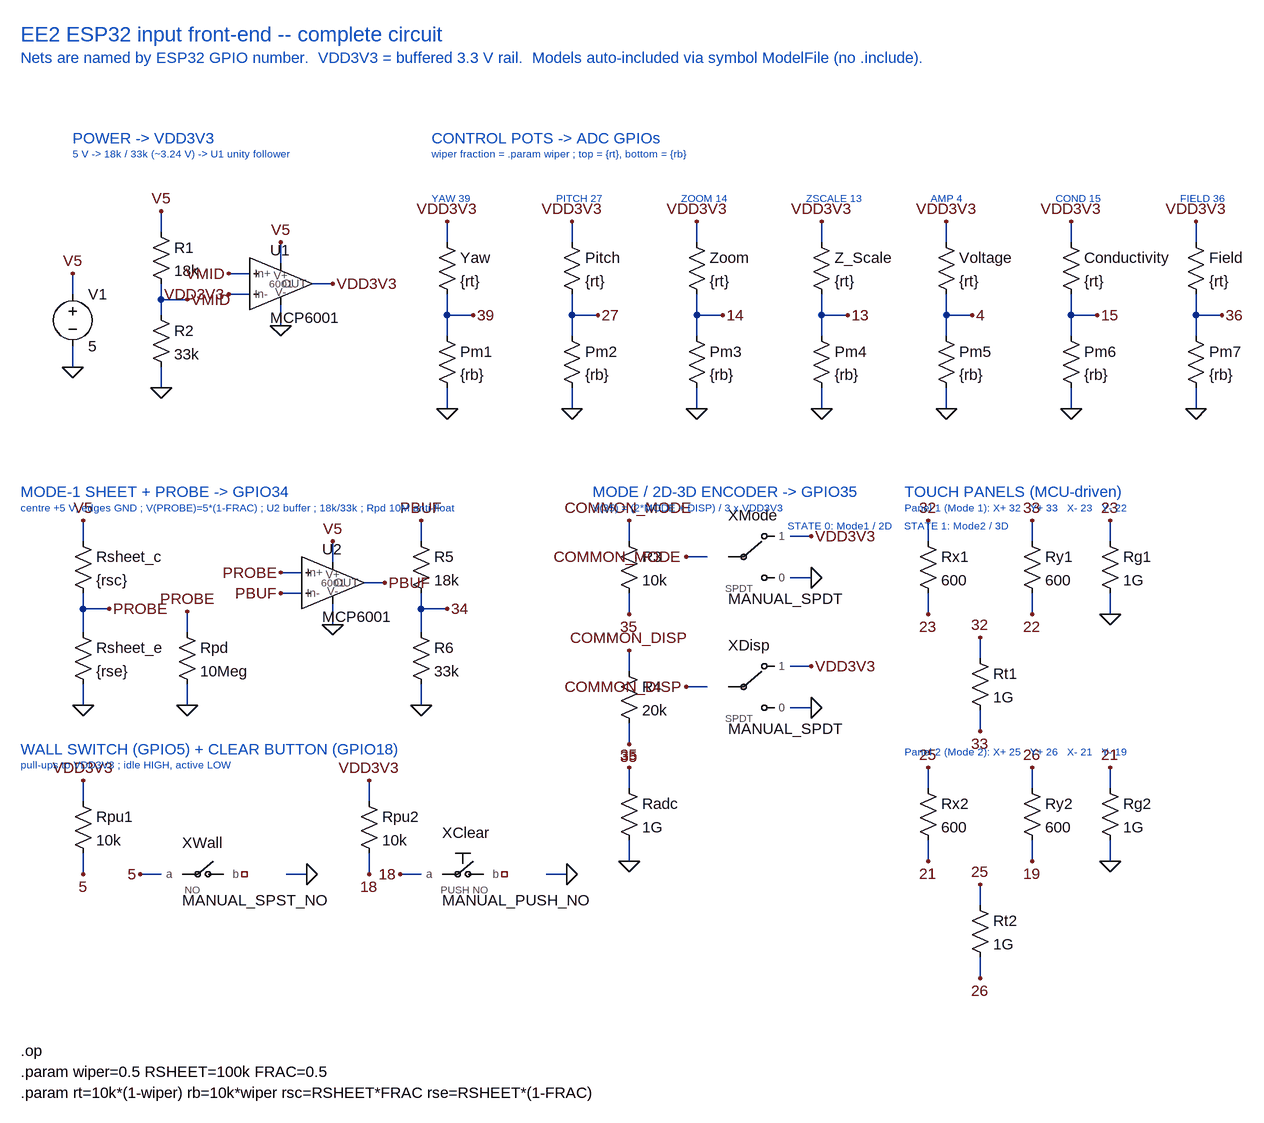
[diagram p0: schematic circuit_design_manual.asc]
circuit_design_manual.asc, the LTspice schematic file:
Version 4.1
SHEET 1 2000 1700
WIRE -400 -16 -400 16
WIRE -400 96 -400 128
WIRE -264 -112 -264 -80
WIRE -264 0 -264 48
WIRE -264 24 -224 24
WIRE -264 128 -264 160
WIRE -160 -16 -128 -16
WIRE -160 16 -128 16
WIRE -80 -64 -80 -32
WIRE -80 32 -80 64
WIRE -32 0 0 0
WIRE 176 -96 176 -64
WIRE 176 16 176 80
WIRE 176 48 216 48
WIRE 176 160 176 192
WIRE 368 -96 368 -64
WIRE 368 16 368 80
WIRE 368 48 408 48
WIRE 368 160 368 192
WIRE 560 -96 560 -64
WIRE 560 16 560 80
WIRE 560 48 600 48
WIRE 560 160 560 192
WIRE 752 -96 752 -64
WIRE 752 16 752 80
WIRE 752 48 792 48
WIRE 752 160 752 192
WIRE 944 -96 944 -64
WIRE 944 16 944 80
WIRE 944 48 984 48
WIRE 944 160 944 192
WIRE 1136 -96 1136 -64
WIRE 1136 16 1136 80
WIRE 1136 48 1176 48
WIRE 1136 160 1136 192
WIRE 1328 -96 1328 -64
WIRE 1328 16 1328 80
WIRE 1328 48 1368 48
WIRE 1328 160 1328 192
WIRE 456 364 456 396
WIRE 456 476 456 508
WIRE 544 420 576 420
WIRE 704 388 736 388
WIRE 704 452 736 452
WIRE 456 564 456 596
WIRE 456 676 456 708
WIRE 544 620 576 620
WIRE 704 588 736 588
WIRE 704 652 736 652
WIRE 456 744 456 776
WIRE 456 856 456 888
WIRE -384 364 -384 396
WIRE -384 476 -384 536
WIRE -384 500 -344 500
WIRE -384 616 -384 648
WIRE -224 504 -224 536
WIRE -224 616 -224 648
WIRE -80 444 -48 444
WIRE -80 476 -48 476
WIRE 0 396 0 428
WIRE 0 492 0 524
WIRE 48 460 80 460
WIRE 136 364 136 396
WIRE 136 476 136 536
WIRE 136 500 176 500
WIRE 136 616 136 648
WIRE 916 364 916 396
WIRE 916 476 916 508
WIRE 1076 364 1076 396
WIRE 1076 476 1076 508
WIRE 996 544 996 576
WIRE 996 656 996 688
WIRE 1196 364 1196 396
WIRE 1196 476 1196 508
WIRE 916 744 916 776
WIRE 916 856 916 888
WIRE 1076 744 1076 776
WIRE 1076 856 1076 888
WIRE 996 924 996 956
WIRE 996 1036 996 1068
WIRE 1196 744 1196 776
WIRE 1196 856 1196 888
WIRE -384 764 -384 796
WIRE -384 876 -384 908
WIRE -296 908 -264 908
WIRE -72 908 -40 908
WIRE 56 764 56 796
WIRE 56 876 56 908
WIRE 104 908 136 908
WIRE 328 908 360 908
FLAG -400 -16 V5
FLAG -400 128 0
FLAG -264 -112 V5
FLAG -224 24 VMID
FLAG -264 160 0
FLAG -160 -16 VMID
FLAG -160 16 VDD3V3
FLAG -80 -64 V5
FLAG -80 64 0
FLAG 0 0 VDD3V3
FLAG 176 -96 VDD3V3
FLAG 216 48 39
FLAG 176 192 0
FLAG 368 -96 VDD3V3
FLAG 408 48 27
FLAG 368 192 0
FLAG 560 -96 VDD3V3
FLAG 600 48 14
FLAG 560 192 0
FLAG 752 -96 VDD3V3
FLAG 792 48 13
FLAG 752 192 0
FLAG 944 -96 VDD3V3
FLAG 984 48 4
FLAG 944 192 0
FLAG 1136 -96 VDD3V3
FLAG 1176 48 15
FLAG 1136 192 0
FLAG 1328 -96 VDD3V3
FLAG 1368 48 36
FLAG 1328 192 0
FLAG 456 364 COMMON_MODE
FLAG 456 508 35
FLAG 544 420 COMMON_MODE
FLAG 736 388 VDD3V3
FLAG 736 452 0
FLAG 456 564 COMMON_DISP
FLAG 456 708 35
FLAG 544 620 COMMON_DISP
FLAG 736 588 VDD3V3
FLAG 736 652 0
FLAG 456 744 35
FLAG 456 888 0
FLAG -384 364 V5
FLAG -344 500 PROBE
FLAG -384 648 0
FLAG -224 504 PROBE
FLAG -224 648 0
FLAG -80 444 PROBE
FLAG -80 476 PBUF
FLAG 0 396 V5
FLAG 0 524 0
FLAG 80 460 PBUF
FLAG 136 364 PBUF
FLAG 176 500 34
FLAG 136 648 0
FLAG 916 364 32
FLAG 916 508 23
FLAG 1076 364 33
FLAG 1076 508 22
FLAG 996 544 32
FLAG 996 688 33
FLAG 1196 364 23
FLAG 1196 508 0
FLAG 916 744 25
FLAG 916 888 21
FLAG 1076 744 26
FLAG 1076 888 19
FLAG 996 924 25
FLAG 996 1068 26
FLAG 1196 744 21
FLAG 1196 888 0
FLAG -384 764 VDD3V3
FLAG -384 908 5
FLAG -296 908 5
FLAG -40 908 0
FLAG 56 764 VDD3V3
FLAG 56 908 18
FLAG 104 908 18
FLAG 360 908 0
SYMBOL voltage -400 0 R0
WINDOW 123 0 0 Left 0
WINDOW 39 0 0 Left 0
SYMATTR InstName V1
SYMATTR Value 5
SYMBOL res -280 -96 R0
SYMATTR InstName R1
SYMATTR Value 18k
SYMBOL res -280 32 R0
SYMATTR InstName R2
SYMATTR Value 33k
SYMBOL MCP6001 -80 0 R0
SYMATTR InstName U1
SYMBOL res 160 -80 R0
SYMATTR InstName Yaw
SYMATTR Value {rt}
SYMBOL res 160 64 R0
SYMATTR InstName Pm1
SYMATTR Value {rb}
SYMBOL res 352 -80 R0
SYMATTR InstName Pitch
SYMATTR Value {rt}
SYMBOL res 352 64 R0
SYMATTR InstName Pm2
SYMATTR Value {rb}
SYMBOL res 544 -80 R0
SYMATTR InstName Zoom
SYMATTR Value {rt}
SYMBOL res 544 64 R0
SYMATTR InstName Pm3
SYMATTR Value {rb}
SYMBOL res 736 -80 R0
SYMATTR InstName Z_Scale
SYMATTR Value {rt}
SYMBOL res 736 64 R0
SYMATTR InstName Pm4
SYMATTR Value {rb}
SYMBOL res 928 -80 R0
SYMATTR InstName Voltage
SYMATTR Value {rt}
SYMBOL res 928 64 R0
SYMATTR InstName Pm5
SYMATTR Value {rb}
SYMBOL res 1120 -80 R0
SYMATTR InstName Conductivity
SYMATTR Value {rt}
SYMBOL res 1120 64 R0
SYMATTR InstName Pm6
SYMATTR Value {rb}
SYMBOL res 1312 -80 R0
SYMATTR InstName Field
SYMATTR Value {rt}
SYMBOL res 1312 64 R0
SYMATTR InstName Pm7
SYMATTR Value {rb}
SYMBOL res 440 380 R0
SYMATTR InstName R3
SYMATTR Value 10k
SYMBOL MANUAL_SPDT 640 420 R0
SYMATTR InstName XMode
SYMATTR SpiceLine STATE=0
SYMBOL res 440 580 R0
SYMATTR InstName R4
SYMATTR Value 20k
SYMBOL MANUAL_SPDT 640 620 R0
SYMATTR InstName XDisp
SYMATTR SpiceLine STATE=0
SYMBOL res 440 760 R0
SYMATTR InstName Radc
SYMATTR Value 1G
SYMBOL res -400 380 R0
SYMATTR InstName Rsheet_c
SYMATTR Value {rsc}
SYMBOL res -400 520 R0
SYMATTR InstName Rsheet_e
SYMATTR Value {rse}
SYMBOL res -240 520 R0
SYMATTR InstName Rpd
SYMATTR Value 10Meg
SYMBOL MCP6001 0 460 R0
SYMATTR InstName U2
SYMBOL res 120 380 R0
SYMATTR InstName R5
SYMATTR Value 18k
SYMBOL res 120 520 R0
SYMATTR InstName R6
SYMATTR Value 33k
SYMBOL res 900 380 R0
SYMATTR InstName Rx1
SYMATTR Value 600
SYMBOL res 1060 380 R0
SYMATTR InstName Ry1
SYMATTR Value 600
SYMBOL res 980 560 R0
SYMATTR InstName Rt1
SYMATTR Value 1G
SYMBOL res 1180 380 R0
SYMATTR InstName Rg1
SYMATTR Value 1G
SYMBOL res 900 760 R0
SYMATTR InstName Rx2
SYMATTR Value 600
SYMBOL res 1060 760 R0
SYMATTR InstName Ry2
SYMATTR Value 600
SYMBOL res 980 940 R0
SYMATTR InstName Rt2
SYMATTR Value 1G
SYMBOL res 1180 760 R0
SYMATTR InstName Rg2
SYMATTR Value 1G
SYMBOL res -400 780 R0
SYMATTR InstName Rpu1
SYMATTR Value 10k
SYMBOL MANUAL_SPST_NO -200 908 R0
SYMATTR InstName XWall
SYMATTR SpiceLine STATE=0
SYMBOL res 40 780 R0
SYMATTR InstName Rpu2
SYMATTR Value 10k
SYMBOL MANUAL_PUSH_NO 200 900 R0
SYMATTR InstName XClear
SYMATTR SpiceLine PRESS=0
TEXT -480 -384 Left 3 ;EE2 ESP32 input front-end -- complete circuit
TEXT -480 -348 Left 2 ;Nets are named by ESP32 GPIO number.  VDD3V3 = buffered 3.3 V rail.  Models auto-included via symbol ModelFile (no .include).
TEXT -400 -224 Left 2 ;POWER -> VDD3V3
TEXT -400 -200 Left 1 ;5 V -> 18k / 33k (~3.24 V) -> U1 unity follower
TEXT 152 -224 Left 2 ;CONTROL POTS -> ADC GPIOs
TEXT 152 -200 Left 1 ;wiper fraction = .param wiper ; top = {rt}, bottom = {rb}
TEXT 152 -132 Left 1 ;YAW 39
TEXT 344 -132 Left 1 ;PITCH 27
TEXT 536 -132 Left 1 ;ZOOM 14
TEXT 728 -132 Left 1 ;ZSCALE 13
TEXT 920 -132 Left 1 ;AMP 4
TEXT 1112 -132 Left 1 ;COND 15
TEXT 1304 -132 Left 1 ;FIELD 36
TEXT -480 320 Left 2 ;MODE-1 SHEET + PROBE -> GPIO34
TEXT -480 344 Left 1 ;centre +5 V, edges GND ; V(PROBE)=5*(1-FRAC) ; U2 buffer ; 18k/33k ; Rpd 10M anti-float
TEXT 400 320 Left 2 ;MODE / 2D-3D ENCODER -> GPIO35
TEXT 400 344 Left 1 ;V(35) = (2*MODE + DISP) / 3 x VDD3V3
TEXT 700 372 Left 1 ;STATE 0: Mode1 / 2D    STATE 1: Mode2 / 3D
TEXT 880 320 Left 2 ;TOUCH PANELS (MCU-driven)
TEXT 880 344 Left 1 ;Panel 1 (Mode 1): X+ 32   Y+ 33   X- 23   Y- 22
TEXT 880 720 Left 1 ;Panel 2 (Mode 2): X+ 25   Y+ 26   X- 21   Y- 19
TEXT -480 716 Left 2 ;WALL SWITCH (GPIO5) + CLEAR BUTTON (GPIO18)
TEXT -480 740 Left 1 ;pull-ups to VDD3V3 ; idle HIGH, active LOW
TEXT -480 1180 Left 2 !.op
TEXT -480 1212 Left 2 !.param wiper=0.5 RSHEET=100k FRAC=0.5
TEXT -480 1244 Left 2 !.param rt=10k*(1-wiper) rb=10k*wiper rsc=RSHEET*FRAC rse=RSHEET*(1-FRAC)

The netlist it stands for:
* circuit_design_manual.asc
V1 V5 0 5
R1 V5 VMID 18k
R2 VMID 0 33k
X§U1 VMID VDD3V3 V5 0 VDD3V3 MCP6001  ; pins In+ In- V+ V- OUT
R§Yaw VDD3V3 39 {rt}
R§Pm1 39 0 {rb}
R§Pitch VDD3V3 27 {rt}
R§Pm2 27 0 {rb}
R§Zoom VDD3V3 14 {rt}
R§Pm3 14 0 {rb}
R§Z_Scale VDD3V3 13 {rt}
R§Pm4 13 0 {rb}
R§Voltage VDD3V3 4 {rt}
R§Pm5 4 0 {rb}
R§Conductivity VDD3V3 15 {rt}
R§Pm6 15 0 {rb}
R§Field VDD3V3 36 {rt}
R§Pm7 36 0 {rb}
R3 COMMON_MODE 35 10k
X§XMode COMMON_MODE VDD3V3 0 MANUAL_SPDT STATE=0  ; pins ? 1 0
R4 COMMON_DISP 35 20k
X§XDisp COMMON_DISP VDD3V3 0 MANUAL_SPDT STATE=0  ; pins ? 1 0
Radc 35 0 1G
Rsheet_c V5 PROBE {rsc}
Rsheet_e PROBE 0 {rse}
Rpd PROBE 0 10Meg
X§U2 PROBE PBUF V5 0 PBUF MCP6001  ; pins In+ In- V+ V- OUT
R5 PBUF 34 18k
R6 34 0 33k
Rx1 32 23 600
Ry1 33 22 600
Rt1 32 33 1G
Rg1 23 0 1G
Rx2 25 21 600
Ry2 26 19 600
Rt2 25 26 1G
Rg2 21 0 1G
Rpu1 VDD3V3 5 10k
X§XWall 5 NC_01 MANUAL_SPST_NO STATE=0  ; pins a b
Rpu2 VDD3V3 18 10k
X§XClear 18 NC_02 MANUAL_PUSH_NO PRESS=0  ; pins a b
* EE2 ESP32 input front-end -- complete circuit
* Nets are named by ESP32 GPIO number.  VDD3V3 = buffered 3.3 V rail.  Models auto-included via symbol ModelFile (no .include).
* POWER -> VDD3V3
* 5 V -> 18k / 33k (~3.24 V) -> U1 unity follower
* CONTROL POTS -> ADC GPIOs
* wiper fraction = .param wiper ; top = {rt}, bottom = {rb}
* YAW 39
* PITCH 27
* ZOOM 14
* ZSCALE 13
* AMP 4
* COND 15
* FIELD 36
* MODE-1 SHEET + PROBE -> GPIO34
* centre +5 V, edges GND ; V(PROBE)=5*(1-FRAC) ; U2 buffer ; 18k/33k ; Rpd 10M anti-float
* MODE / 2D-3D ENCODER -> GPIO35
* V(35) = (2*MODE + DISP) / 3 x VDD3V3
* STATE 0: Mode1 / 2D    STATE 1: Mode2 / 3D
* TOUCH PANELS (MCU-driven)
* Panel 1 (Mode 1): X+ 32   Y+ 33   X- 23   Y- 22
* Panel 2 (Mode 2): X+ 25   Y+ 26   X- 21   Y- 19
* WALL SWITCH (GPIO5) + CLEAR BUTTON (GPIO18)
* pull-ups to VDD3V3 ; idle HIGH, active LOW
.op
.param wiper=0.5 RSHEET=100k FRAC=0.5
.param rt=10k*(1-wiper) rb=10k*wiper rsc=RSHEET*FRAC rse=RSHEET*(1-FRAC)
.lib MCP6001.lib
.lib ManualSwitch.lib
.backanno
.end